# EAGLE design midi (EAGLE 6.1)
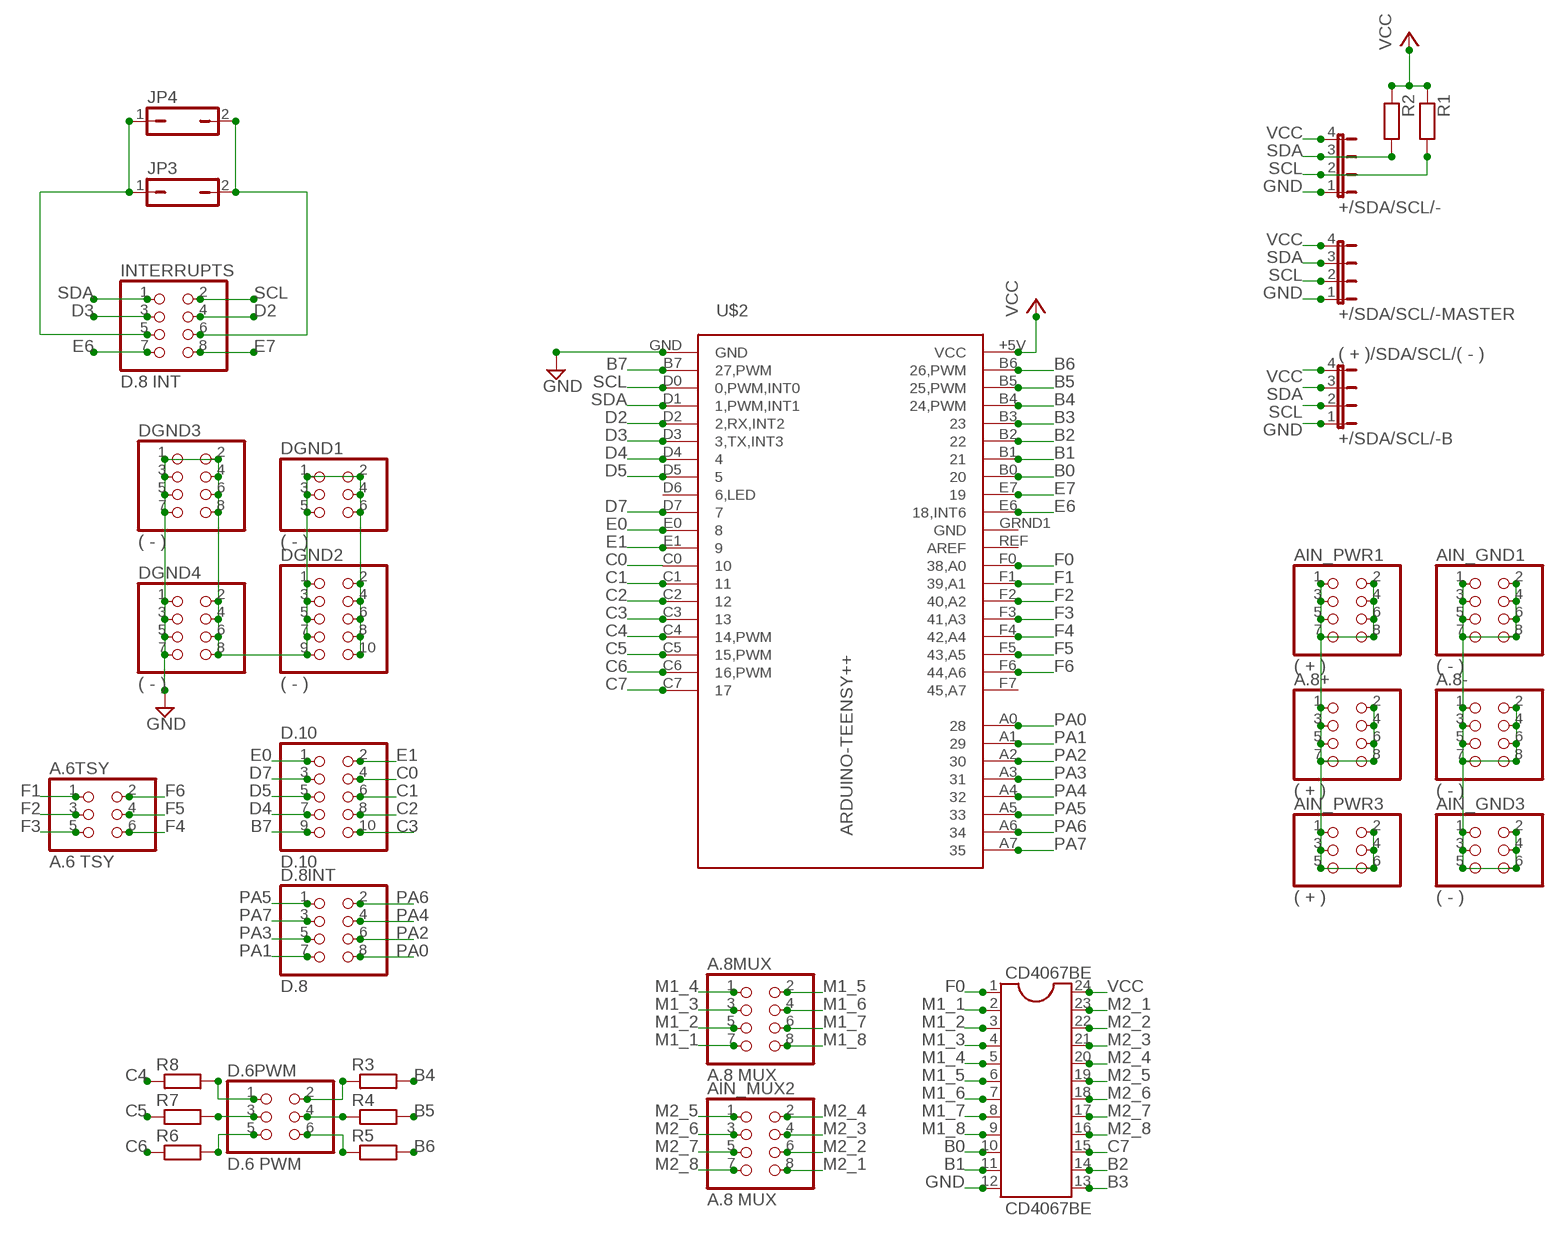
[diagram p0: schematic, sheet 1]

## Parts
+/SDA/SCL/-  JP4E  [JP4]
+/SDA/SCL/-B  ( + )/SDA/SCL/( - )  JP4E  [JP4]
+/SDA/SCL/-MASTER  JP4E  [JP4]
A.6TSY  A.6 TSY  PINHD-2X3  [2X03]
A.8+  ( + )  PINHD-2X4  [2X04]
A.8-  ( - )  PINHD-2X4  [2X04]
A.8MUX  A.8 MUX  PINHD-2X4  [2X04]
AIN_GND1  ( - )  PINHD-2X4  [2X04]
AIN_GND3  ( - )  PINHD-2X3  [2X03]
AIN_MUX2  A.8 MUX  PINHD-2X4  [2X04]
AIN_PWR1  ( + )  PINHD-2X4  [2X04]
AIN_PWR3  ( + )  PINHD-2X3  [2X03]
CD4067BE  CD4067BE  DIL24-6  [DIL24-6]
D.6PWM  D.6 PWM  PINHD-2X3  [2X03]
D.8INT  D.8  PINHD-2X4  [2X04]
D.10  D.10  PINHD-2X5  [2X05]
DGND1  ( - )  PINHD-2X3  [2X03]
DGND2  ( - )  PINHD-2X5  [2X05]
DGND3  ( - )  PINHD-2X4  [2X04]
DGND4  ( - )  PINHD-2X4  [2X04]
INTERRUPTS  D.8 INT  PINHD-2X4  [2X04]
JP3  JP1Q  [JP1]
JP4  JP1Q  [JP1]
R1  6MM-EU  [R0207/3]
R2  6MM-EU  [R0207/3]
R3  6MM-EU  [R0207/3]
R4  6MM-EU  [R0207/3]
R5  6MM-EU  [R0207/3]
R6  6MM-EU  [R0207/3]
R7  6MM-EU  [R0207/3]
R8  6MM-EU  [R0207/3]
U$2  ARDUINO-TEENSY++  [TEENSY++]

## Nets
B0: CD4067BE.10 U$2.B0
B1: CD4067BE.11 U$2.B1
B2: CD4067BE.14 U$2.B2
B3: CD4067BE.13 U$2.B3
B4: R3.2 U$2.B4(24,PWM)
B5: R4.2 U$2.B5(25,PWM)
B6: R5.2 U$2.B6(26,PWM)
B7: D.10.9 U$2.B7(27,PWM)
C0: D.10.4 U$2.C0
C1: D.10.6 U$2.C1
C2: D.10.8 U$2.C2
C3: D.10.10 U$2.C3
C4: R8.1 U$2.C4(14,PWM)
C5: R7.1 U$2.C5(15,PWM)
C6: R6.1 U$2.C6(16,PWM)
C7: CD4067BE.15 U$2.C7
D2: INTERRUPTS.4 U$2.D2(2,RX,INT2)
D3: INTERRUPTS.3 U$2.D3(3,TX,INT3)
D4: D.10.7 U$2.D4
D5: D.10.5 U$2.D5
D7: D.10.3 U$2.D7
E0: D.10.1 U$2.E0
E1: D.10.2 U$2.E1
E6: INTERRUPTS.7 U$2.E6(18,INT6)
E7: INTERRUPTS.8 U$2.E7
F0: CD4067BE.1 U$2.F0(38,A0)
F1: A.6TSY.1 U$2.F1(39,A1)
F2: A.6TSY.3 U$2.F2(40,A2)
F3: A.6TSY.5 U$2.F3(41,A3)
F4: A.6TSY.6 U$2.F4(42,A4)
F5: A.6TSY.4 U$2.F5(43,A5)
F6: A.6TSY.2 U$2.F6(44,A6)
GND: +/SDA/SCL/-.1 +/SDA/SCL/-B.1 +/SDA/SCL/-MASTER.1 A.8-.1 A.8-.2 A.8-.3 A.8-.4 A.8-.5 A.8-.6 A.8-.7 A.8-.8 AIN_GND1.1 AIN_GND1.2 AIN_GND1.3 AIN_GND1.4 AIN_GND1.5 AIN_GND1.6 AIN_GND1.7 AIN_GND1.8 AIN_GND3.1 AIN_GND3.2 AIN_GND3.3 AIN_GND3.4 AIN_GND3.5 AIN_GND3.6 CD4067BE.12 DGND1.1 DGND1.2 DGND1.3 DGND1.4 DGND1.5 DGND1.6 DGND2.1 DGND2.2 DGND2.3 DGND2.4 DGND2.5 DGND2.6 DGND2.7 DGND2.8 DGND2.9 DGND2.10 DGND3.1 DGND3.2 DGND3.3 DGND3.4 DGND3.5 DGND3.6 DGND3.7 DGND3.8 DGND4.1 DGND4.2 DGND4.3 DGND4.4 DGND4.5 DGND4.6 DGND4.7 DGND4.8 U$2.GND
INT4: INTERRUPTS.6 JP3.2 JP4.2
INT5: INTERRUPTS.5 JP3.1 JP4.1
M1_1: A.8MUX.7 CD4067BE.2
M1_2: A.8MUX.5 CD4067BE.3
M1_3: A.8MUX.3 CD4067BE.4
M1_4: A.8MUX.1 CD4067BE.5
M1_5: A.8MUX.2 CD4067BE.6
M1_6: A.8MUX.4 CD4067BE.7
M1_7: A.8MUX.6 CD4067BE.8
M1_8: A.8MUX.8 CD4067BE.9
M2_1: AIN_MUX2.8 CD4067BE.23
M2_2: AIN_MUX2.6 CD4067BE.22
M2_3: AIN_MUX2.4 CD4067BE.21
M2_4: AIN_MUX2.2 CD4067BE.20
M2_5: AIN_MUX2.1 CD4067BE.19
M2_6: AIN_MUX2.3 CD4067BE.18
M2_7: AIN_MUX2.5 CD4067BE.17
M2_8: AIN_MUX2.7 CD4067BE.16
N$1: D.6PWM.2 R3.1
N$2: D.6PWM.4 R4.1
N$4: D.6PWM.6 R5.1
N$5: D.6PWM.5 R6.2
N$6: D.6PWM.3 R7.2
N$8: D.6PWM.1 R8.2
PA0: D.8INT.8 U$2.A0
PA1: D.8INT.7 U$2.A1
PA2: D.8INT.6 U$2.A2
PA3: D.8INT.5 U$2.A3
PA4: D.8INT.4 U$2.A4
PA5: D.8INT.1 U$2.A5
PA6: D.8INT.2 U$2.A6
PA7: D.8INT.3 U$2.A7
SCL: +/SDA/SCL/-.2 +/SDA/SCL/-B.2 +/SDA/SCL/-MASTER.2 INTERRUPTS.2 R1.2 U$2.D0(0,PWM,INT0)
SDA: +/SDA/SCL/-.3 +/SDA/SCL/-B.3 +/SDA/SCL/-MASTER.3 INTERRUPTS.1 R2.2 U$2.D1(1,PWM,INT1)
VCC: +/SDA/SCL/-.4 +/SDA/SCL/-B.4 +/SDA/SCL/-MASTER.4 A.8+.1 A.8+.2 A.8+.3 A.8+.4 A.8+.5 A.8+.6 A.8+.7 A.8+.8 AIN_PWR1.1 AIN_PWR1.2 AIN_PWR1.3 AIN_PWR1.4 AIN_PWR1.5 AIN_PWR1.6 AIN_PWR1.7 AIN_PWR1.8 AIN_PWR3.1 AIN_PWR3.2 AIN_PWR3.3 AIN_PWR3.4 AIN_PWR3.5 AIN_PWR3.6 CD4067BE.24 R1.1 R2.1 U$2.+5V(VCC)
Unconnected: U$2.D6(6,LED) U$2.F7(45,A7) U$2.REF(AREF)

## Power pins joined to a net without a drawn wire
GND: U$2.GRND1(GND)

## Library data of the parts
+/SDA/SCL/- +/SDA/SCL/-B +/SDA/SCL/-MASTER = jumper:JP4E: JUMPER
A.6TSY AIN_GND3 AIN_PWR3 D.6PWM DGND1 = pinhead:PINHD-2X3: PIN HEADER
A.8+ A.8- A.8MUX AIN_GND1 AIN_MUX2 AIN_PWR1 D.8INT DGND3 DGND4 INTERRUPTS = pinhead:PINHD-2X4: PIN HEADER
CD4067BE = ic-package:DIL24: Dual In Line
D.10 DGND2 = pinhead:PINHD-2X5: PIN HEADER
JP3 JP4 = jumper:JP1Q: JUMPER
R1-R8 = gm-resistors:6MM-EU: 6mm Resistors (European schematic symbol) Leads spaced 1-6 holes apart for 0.1" perfboard. Suitable for 1/4 watt resistors.
U$2 = teensypp_rmPins:ARDUINO-TEENSY++

## Board
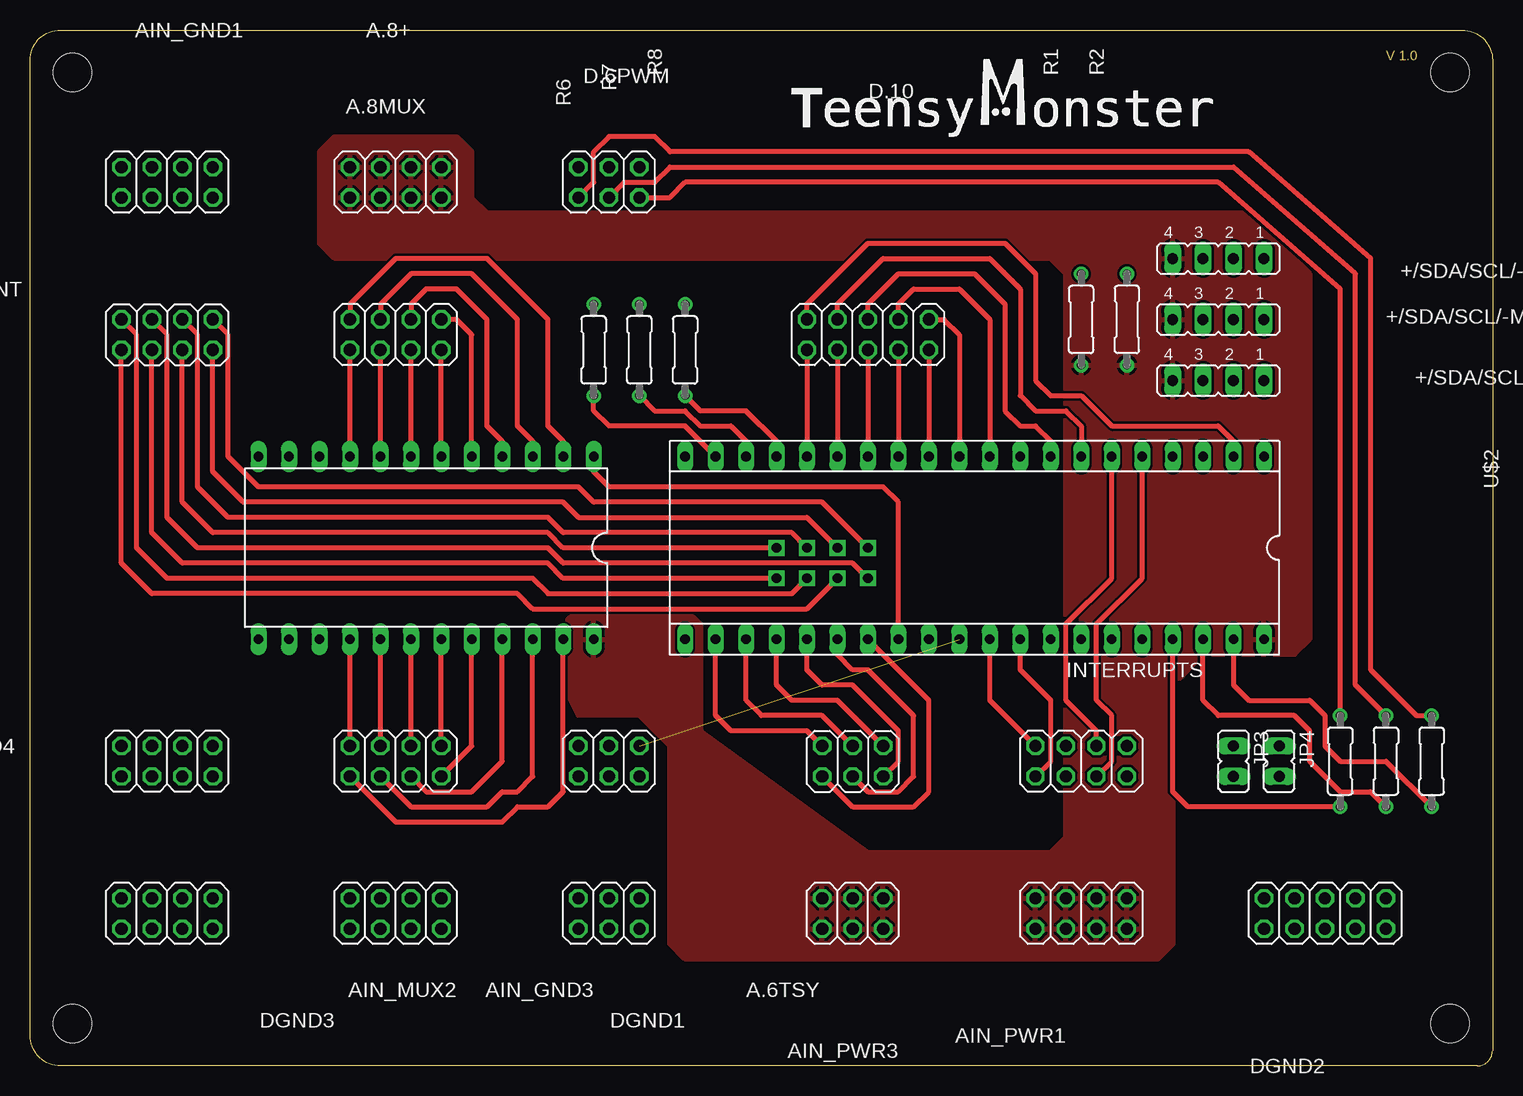
[diagram p1: board, top side]
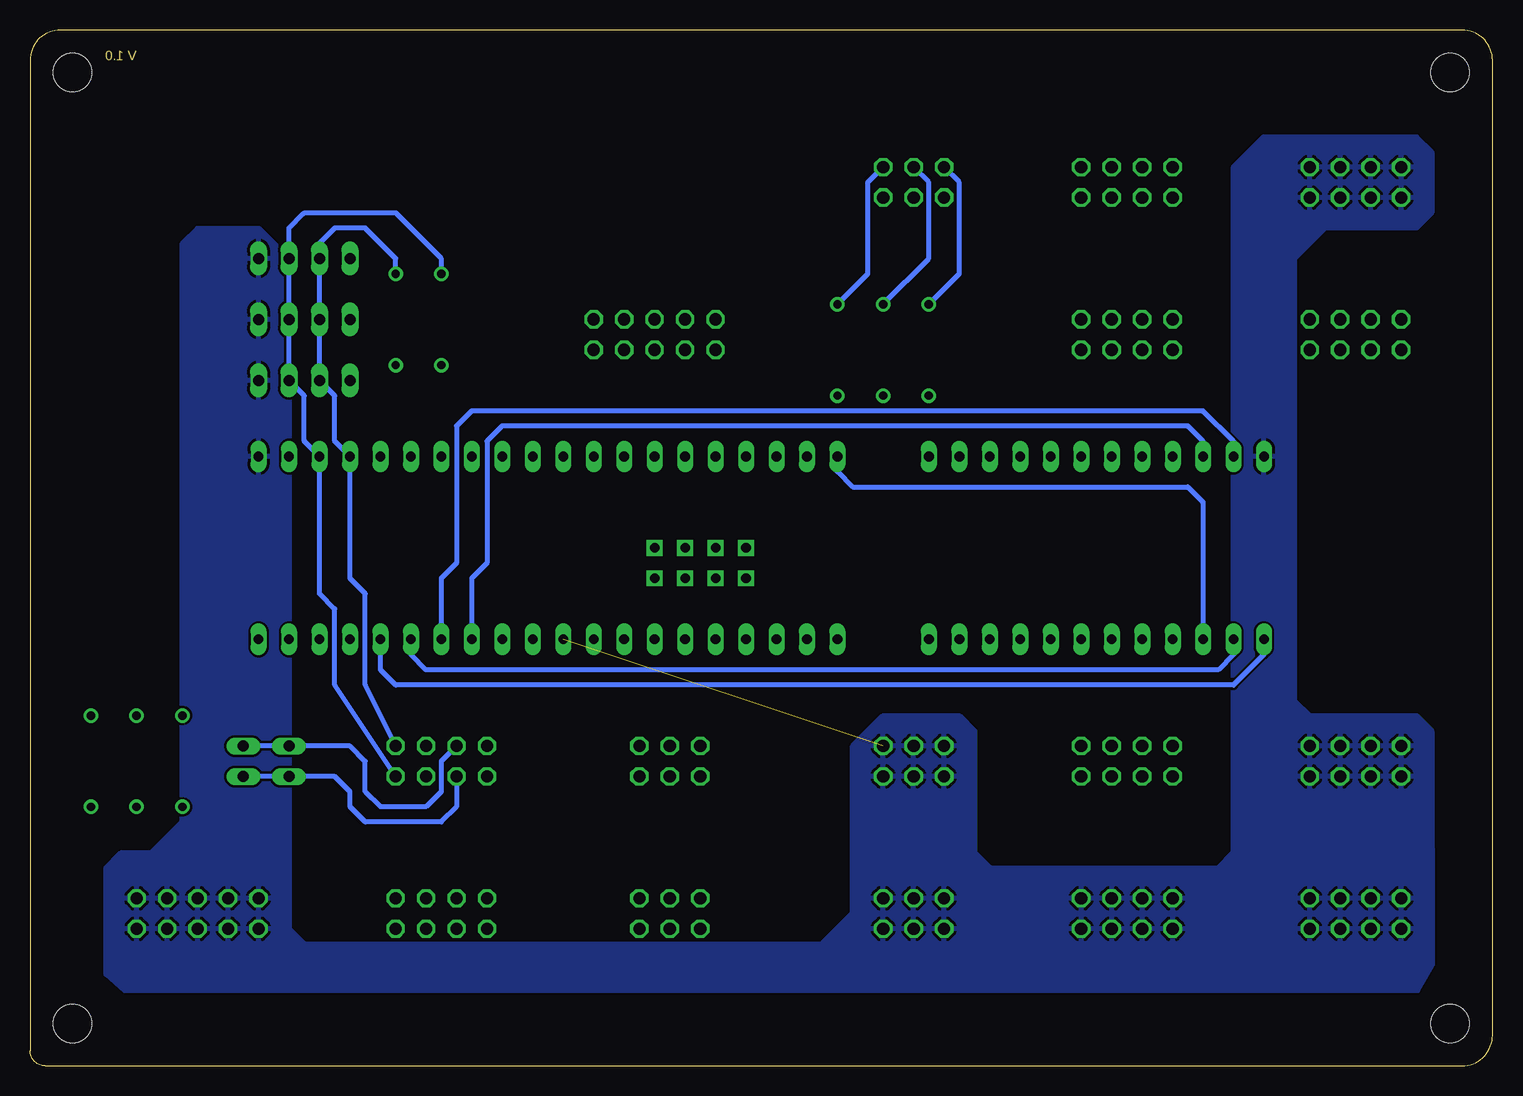
[diagram p2: board, bottom side, seen from below]

Size 121.92 x 86.36 mm. Coordinates in mm from the lower left corner, seen from the top.
Outline: 120.65,0 2.54,0 arc-90 0,2.54 0,83.82 arc-90 2.54,86.36 119.38,86.36 arc-90 121.92,83.82 121.92,1.27 arc-90 120.65,0
Copper layers (1*16): Top 0.035mm / dielectric 1.5mm / Bottom 0.035mm
Design rules: minimum track width 10mil, minimum drill 24mil, track to track 8mil, track to pad 8mil, pad to pad 8mil, via to via 8mil, smd to smd 8mil, copper to edge 40mil, drill to drill 8mil, minimum pad ring 10mil, minimum via ring 8mil, stop-mask expansion 4mil, vias tented up to drill 0mil, thermal gap 10mil
Holes 3.2 mm at 3.54,82.82 3.54,3.54 118.38,3.54 118.38,82.82

### Footprints (pad centres in the part's own frame; a part is rotated, then mirrored left to right if it is on the bottom)
JP4 = drill 0.914 long: 1 -3.81,0; 2 -1.27,0; 3 1.27,0; 4 3.81,0
2X03 = drill 1.016 octagon: 1 -2.54,-1.27; 2 -2.54,1.27; 3 0,-1.27; 4 0,1.27; 5 2.54,-1.27; 6 2.54,1.27
2X04 = drill 1.016 octagon: 1 -3.81,-1.27; 2 -3.81,1.27; 3 -1.27,-1.27; 4 -1.27,1.27; 5 1.27,-1.27; 6 1.27,1.27; 7 3.81,-1.27; 8 3.81,1.27
DIL24-6 = drill 0.813 long: 1 -13.97,-7.62; 2 -11.43,-7.62; 3 -8.89,-7.62; 4 -6.35,-7.62; 5 -3.81,-7.62; 6 -1.27,-7.62; 7 1.27,-7.62; 8 3.81,-7.62; 9 6.35,-7.62; 10 8.89,-7.62; 11 11.43,-7.62; 12 13.97,-7.62; 13 13.97,7.62; 14 11.43,7.62; 15 8.89,7.62; 16 6.35,7.62; 17 3.81,7.62; 18 1.27,7.62; 19 -1.27,7.62; 20 -3.81,7.62; 21 -6.35,7.62; 22 -8.89,7.62; 23 -11.43,7.62; 24 -13.97,7.62
2X05 = drill 1.016 octagon: 1 -5.08,-1.27; 2 -5.08,1.27; 3 -2.54,-1.27; 4 -2.54,1.27; 5 0,-1.27; 6 0,1.27; 7 2.54,-1.27; 8 2.54,1.27; 9 5.08,-1.27; 10 5.08,1.27
JP1 = drill 0.914 long: 1 0,-1.27; 2 0,1.27
R0207/3 = drill 0.7: 1 -3.81,0; 2 3.81,0
TEENSY++ = drill 0.813 long: +5V -24.13,7.62; B0 -6.35,7.62; B1 -8.89,7.62; B2 -11.43,7.62; B3 -13.97,7.62; B4 -16.51,7.62; B5 -19.05,7.62; B6 -21.59,7.62; B7 -21.59,-7.62; C0 6.35,-7.62; C1 8.89,-7.62; C2 11.43,-7.62; C3 13.97,-7.62; C4 16.51,-7.62; C5 19.05,-7.62; C6 21.59,-7.62; C7 24.13,-7.62; D0 -19.05,-7.62; D1 -16.51,-7.62; D2 -13.97,-7.62; D3 -11.43,-7.62; D4 -8.89,-7.62; D5 -6.35,-7.62; D6 -3.81,-7.62; D7 -1.27,-7.62; E0 1.27,-7.62; E1 3.81,-7.62; E6 -1.27,7.62; E7 -3.81,7.62; F0 6.35,7.62; F1 8.89,7.62; F2 11.43,7.62; F3 13.97,7.62; F4 16.51,7.62; F5 19.05,7.62; F6 21.59,7.62; F7 24.13,7.62; GND -24.13,-7.62; GRND1 1.27,7.62; REF 3.81,7.62 | drill 0.8 square: A0 8.89,0; A1 11.43,0; A2 13.97,0; A3 16.51,0; A4 8.89,2.54; A5 11.43,2.54; A6 13.97,2.54; A7 16.51,2.54

### Placement (x,y rotation side)
+/SDA/SCL/-  99.06,57.15 180 top
+/SDA/SCL/-B  99.06,67.31 180 top
+/SDA/SCL/-MASTER  99.06,62.23 180 top
A.6TSY  68.58,25.4 0 top
A.8+  30.48,73.66 180 top
A.8-  11.43,12.7 180 top
A.8MUX  30.48,60.96 180 top
AIN_GND1  11.43,73.66 180 top
AIN_GND3  48.26,25.4 180 top
AIN_MUX2  30.48,25.4 180 top
AIN_PWR1  87.63,12.7 180 top
AIN_PWR3  68.58,12.7 180 top
CD4067BE  33.02,43.18 180 top
D.6PWM  48.26,73.66 180 top
D.8INT  11.43,60.96 0 top
D.10  69.85,60.96 180 top
DGND1  48.26,12.7 180 top
DGND2  107.95,12.7 180 top
DGND3  30.48,12.7 180 top
DGND4  11.43,25.4 180 top
INTERRUPTS  87.63,25.4 180 top
JP3  100.33,25.4 180 top
JP4  104.14,25.4 180 top
R1  87.63,62.23 90 top
R2  91.44,62.23 90 top
R3  109.22,25.4 270 top
R4  113.03,25.4 270 top
R5  116.84,25.4 270 top
R6  46.99,59.69 90 top
R7  50.8,59.69 90 top
R8  54.61,59.69 90 top
U$2  78.74,43.18 180 top

### Tracks (layer width: path | path; a pad name or v marks a point on that pad's centre or on a via)
B0
  Bottom 0.406: CD4067BE.10 24.13,52.07 25.4,53.34 82.55,53.34 83.82,52.07 83.82,41.91 85.09,40.64 U$2.B0
B1
  Bottom 0.406: CD4067BE.11 21.59,52.07 24.13,54.61 85.09,54.61 86.36,53.34 86.36,41.91 87.63,40.64 U$2.B1
B2
  Bottom 0.406: CD4067BE.14 21.59,34.29 22.86,33.02 88.9,33.02 90.17,34.29 U$2.B2
B3
  Bottom 0.406: CD4067BE.13 19.05,34.29 21.59,31.75 91.44,31.75 92.71,33.02 U$2.B3
B4
  Top 0.406: R3.2 96.52,21.59 95.25,22.86 U$2.B4
B5
  Top 0.406: R4.2 111.76,22.86 109.22,22.86 106.68,25.4 106.68,27.94 105.41,29.21 99.06,29.21 97.79,30.48 U$2.B5
B6
  Top 0.406: U$2.B6 100.33,31.75 101.6,30.48 106.68,30.48 107.95,29.21 107.95,26.67 109.22,25.4 113.03,25.4 R5.2
B7
  Top 0.406: D.10.9 64.77,63.5 69.85,68.58 81.28,68.58 83.82,66.04 83.82,57.15 85.09,55.88 87.63,55.88 90.17,53.34 99.06,53.34 100.33,52.07 U$2.B7
C0
  Top 0.406: D.10.4 U$2.C0
C1
  Top 0.406: D.10.6 U$2.C1
C2
  Top 0.406: D.10.8 U$2.C2
C3
  Top 0.406: D.10.10 U$2.C3
C4
  Top 0.406: U$2.C4 62.23,52.07 59.69,54.61 55.88,54.61 R8.1
C5
  Top 0.406: R7.1 52.07,54.61 54.61,54.61 55.88,53.34 58.42,53.34 59.69,52.07 U$2.C5
C6
  Top 0.406: U$2.C6 54.61,53.34 48.26,53.34 46.99,54.61 R6.1
C7
  Bottom 0.406: U$2.C7 54.61,49.53 53.34,48.26 25.4,48.26 24.13,46.99 CD4067BE.15
D2
  Top 0.406: INTERRUPTS.4 90.17,25.4 90.17,29.21 88.9,30.48 88.9,36.83 92.71,40.64 U$2.D2
D3
  Top 0.406: INTERRUPTS.3 88.9,27.94 86.36,30.48 86.36,36.83 90.17,40.64 U$2.D3
D4
  Top 0.406: D.10.7 67.31,63.5 71.12,67.31 80.01,67.31 82.55,64.77 82.55,55.88 83.82,54.61 86.36,54.61 87.63,53.34 U$2.D4
D5
  Top 0.406: D.10.5 69.85,63.5 72.39,66.04 78.74,66.04 81.28,63.5 81.28,54.61 82.55,53.34 83.82,53.34 85.09,52.07 U$2.D5
D7
  Top 0.406: D.10.3 72.39,63.5 73.66,64.77 77.47,64.77 80.01,62.23 U$2.D7
E0
  Top 0.406: D.10.1 76.2,62.23 77.47,60.96 U$2.E0
E1
  Top 0.406: D.10.2 U$2.E1
E6
  Top 0.406: INTERRUPTS.7 80.01,30.48 U$2.E6
E7
  Top 0.406: INTERRUPTS.8 85.09,25.4 85.09,30.48 82.55,33.02 U$2.E7
F0
  Top 0.406: U$2.F0 72.39,46.99 71.12,48.26 48.26,48.26 46.99,49.53 CD4067BE.1
F1
  Top 0.406: A.6TSY.1 68.58,21.59 73.66,21.59 74.93,22.86 74.93,30.48 U$2.F1
F2
  Top 0.406: A.6TSY.3 69.85,22.86 72.39,22.86 73.66,24.13 73.66,29.21 69.85,33.02 68.58,33.02 67.31,34.29 U$2.F2
F3
  Top 0.406: A.6TSY.5 72.39,25.4 72.39,27.94 68.58,31.75 66.04,31.75 64.77,33.02 U$2.F3
F4
  Top 0.406: A.6TSY.6 67.31,30.48 63.5,30.48 62.23,31.75 U$2.F4
F5
  Top 0.406: A.6TSY.4 66.04,29.21 60.96,29.21 59.69,30.48 U$2.F5
F6
  Top 0.406: A.6TSY.2 64.77,27.94 58.42,27.94 57.15,29.21 U$2.F6
GND  (1 unrouted)
  pour Bottom: 6.35,77.47 5.08,76.2 5.08,71.12 6.35,69.85 13.97,69.85 16.51,67.31 16.51,30.48 15.24,29.21 6.35,29.21 5.08,27.94 5,8.43 6.27,6.25 113.97,6.22 115.57,7.62 115.57,16.51 114.3,17.78 111.76,17.78 109.22,20.32 109.22,68.58 107.95,69.85 102.87,69.85 100.33,67.31 100.33,11.43 99.06,10.16 55.88,10.16 53.34,12.7 53.34,26.67 50.8,29.21 44.45,29.21 43.18,27.94 43.18,17.78 41.91,16.51 22.86,16.51 21.59,17.78 21.59,74.93 19.05,77.47
INT4
  Bottom 0.406: INTERRUPTS.6 86.36,21.59 87.63,20.32 93.98,20.32 95.25,21.59 95.25,22.86 96.52,24.13 JP3.2 JP4.2
INT5
  Bottom 0.406: INTERRUPTS.5 87.63,25.4 87.63,22.86 88.9,21.59 92.71,21.59 93.98,22.86 93.98,25.4 95.25,26.67 JP3.1 JP4.1
M1_1
  Top 0.406: CD4067BE.2 44.45,52.07 43.18,53.34 43.18,62.23 38.1,67.31 30.48,67.31 26.67,63.5 A.8MUX.7
M1_2
  Top 0.406: CD4067BE.3 41.91,52.07 40.64,53.34 40.64,62.23 36.83,66.04 31.75,66.04 29.21,63.5 A.8MUX.5
M1_3
  Top 0.406: CD4067BE.4 39.37,52.07 38.1,53.34 38.1,62.23 35.56,64.77 33.02,64.77 31.75,63.5 A.8MUX.3
M1_4
  Top 0.406: CD4067BE.5 36.83,60.96 35.56,62.23 A.8MUX.1
M1_5
  Top 0.406: CD4067BE.6 A.8MUX.2
M1_6
  Top 0.406: CD4067BE.7 A.8MUX.4
M1_7
  Top 0.406: CD4067BE.8 A.8MUX.6
M1_8
  Top 0.406: CD4067BE.9 A.8MUX.8
M2_1
  Top 0.406: AIN_MUX2.8 30.48,20.32 39.37,20.32 40.64,21.59 43.18,21.59 44.45,22.86 CD4067BE.23
M2_2
  Top 0.406: AIN_MUX2.6 31.75,21.59 38.1,21.59 39.37,22.86 40.64,22.86 41.91,24.13 CD4067BE.22
M2_3
  Top 0.406: AIN_MUX2.4 33.02,22.86 36.83,22.86 39.37,25.4 CD4067BE.21
M2_4
  Top 0.406: AIN_MUX2.2 36.83,26.67 CD4067BE.20
M2_5
  Top 0.406: AIN_MUX2.1 CD4067BE.19
M2_6
  Top 0.406: AIN_MUX2.3 CD4067BE.18
M2_7
  Top 0.406: AIN_MUX2.5 CD4067BE.17
M2_8
  Top 0.406: AIN_MUX2.7 CD4067BE.16
N$1
  Top 0.406: D.6PWM.2 53.34,72.39 54.61,73.66 99.06,73.66 109.22,64.77 R3.1
N$2
  Top 0.406: D.6PWM.4 49.53,73.66 52.07,73.66 53.34,74.93 100.33,74.93 110.49,66.04 110.49,31.75 R4.1
N$4
  Top 0.406: D.6PWM.6 46.99,73.66 46.99,76.2 48.26,77.47 52.07,77.47 53.34,76.2 101.6,76.2 111.76,67.31 111.76,33.02 115.57,29.21 R5.1
N$5
  Bottom 0.406: R6.2 44.45,66.04 44.45,73.66 D.6PWM.5
N$6
  Bottom 0.406: R7.2 46.99,67.31 46.99,73.66 D.6PWM.3
N$8
  Bottom 0.406: R8.2 52.07,66.04 52.07,73.66 D.6PWM.1
PA0
  Top 0.406: U$2.A0 66.04,46.99 46.99,46.99 45.72,48.26 19.05,48.26 16.51,50.8 16.51,60.96 D.8INT.8
PA1
  Top 0.406: U$2.A1 64.77,45.72 45.72,45.72 44.45,46.99 17.78,46.99 15.24,49.53 D.8INT.7
PA2
  Top 0.406: U$2.A2 63.5,44.45 44.45,44.45 43.18,45.72 16.51,45.72 13.97,48.26 13.97,60.96 D.8INT.6
PA3
  Top 0.406: U$2.A3 44.45,43.18 43.18,44.45 15.24,44.45 12.7,46.99 D.8INT.5
PA4
  Top 0.406: U$2.A4 68.58,41.91 44.45,41.91 43.18,43.18 13.97,43.18 11.43,45.72 11.43,60.96 D.8INT.4
PA5
  Top 0.406: U$2.A5 64.77,38.1 41.91,38.1 40.64,39.37 10.16,39.37 7.62,41.91 D.8INT.1
PA6
  Top 0.406: U$2.A6 63.5,39.37 43.18,39.37 41.91,40.64 11.43,40.64 8.89,43.18 8.89,60.96 D.8INT.2
PA7
  Top 0.406: U$2.A7 44.45,40.64 43.18,41.91 12.7,41.91 10.16,44.45 D.8INT.3
SCL
  Bottom 0.406: INTERRUPTS.2 96.52,31.75 96.52,38.1 97.79,39.37 U$2.D0 99.06,52.07 99.06,55.88 +/SDA/SCL/-.2 +/SDA/SCL/-MASTER.2 +/SDA/SCL/-B.2 100.33,69.85 99.13,71.05 arc45 98.96,71.12 91.44,71.12 87.7,67.38 arc45 87.63,67.2 R1.2
SDA
  Bottom 0.406: INTERRUPTS.1 93.98,31.75 93.98,39.37 95.25,40.64 U$2.D1 96.52,52.07 96.52,55.88 +/SDA/SCL/-.3 +/SDA/SCL/-MASTER.3 +/SDA/SCL/-B.3 97.79,68.58 96.52,69.85 93.98,69.85 91.44,67.31 R2.2
VCC
  pour Top: 54.61,8.89 53.34,10.16 53.34,26.67 50.8,29.21 45.72,29.21 44.45,31.75 44.45,36.83 45.72,38.1 54.61,38.1 55.88,36.83 55.88,27.94 69.85,17.78 85.09,17.78 86.36,19.05 86.36,66.04 85.09,67.31 25.4,67.31 24.13,68.58 24.13,76.2 25.4,77.47 35.56,77.47 36.83,76.2 36.83,72.39 38.1,71.12 101.6,71.12 106.68,66.04 106.68,35.56 105.41,34.29 97.79,34.29 95.25,31.75 95.25,10.16 93.98,8.89

### Text on the board
Dimension: V 1.0